# EAGLE design wheel-control (EAGLE 7.5.0)
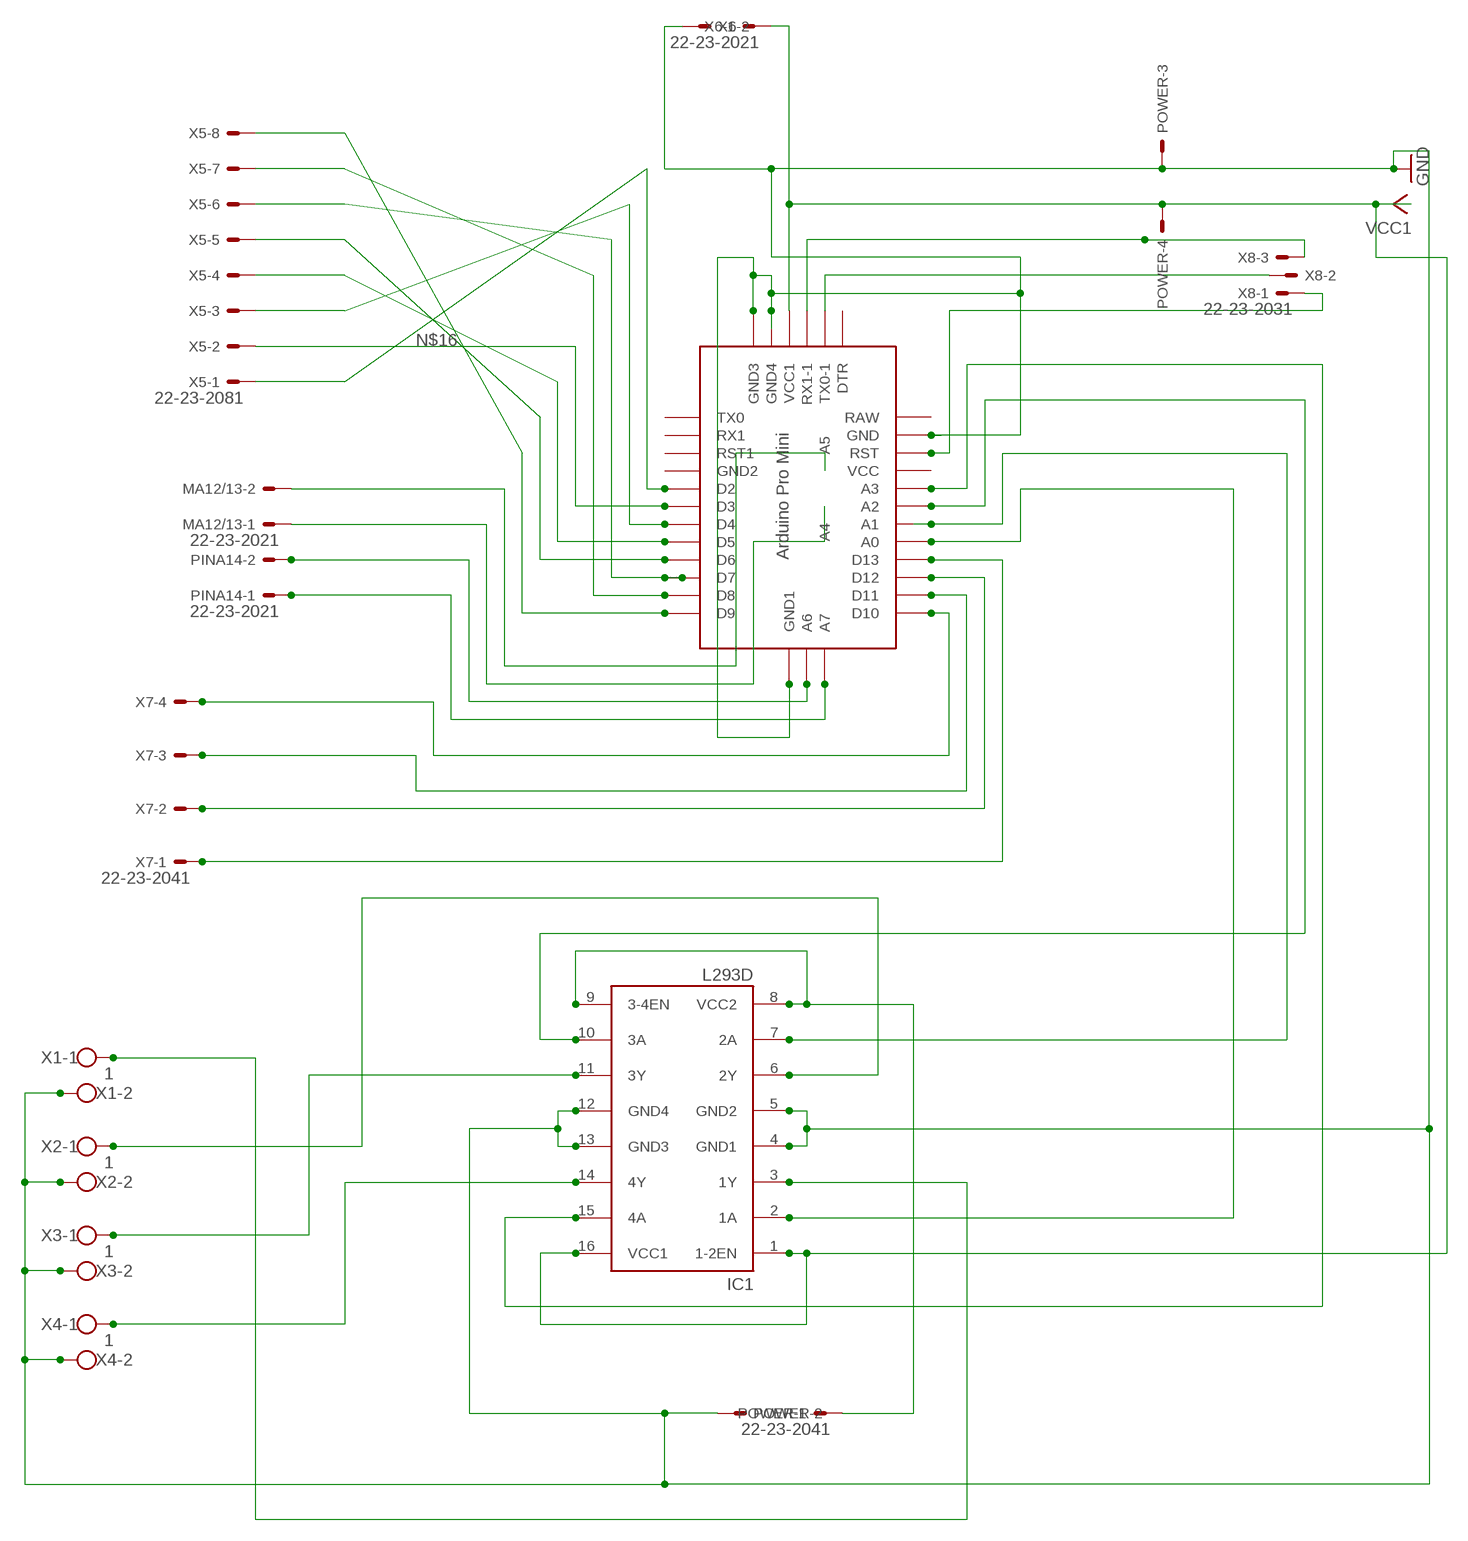
[diagram p0: schematic, sheet 1]

## Parts
IC1  L293D  [DIL16]
MA12/13  22-23-2021  [22-23-2021]
PINA14  22-23-2021  [22-23-2021]
POWER  22-23-2041  [22-23-2041]
U$1  ABK-PRO-MINI  [ABK-PRO-MINI]
X1  1  W237-102  [W237-102]
X2  1  W237-102  [W237-102]
X3  1  W237-102  [W237-102]
X4  1  W237-102  [W237-102]
X5  22-23-2081  [22-23-2081]
X6  22-23-2021  [22-23-2021]
X7  22-23-2041  [22-23-2041]
X8  22-23-2031  [22-23-2031]

## Nets
GND: IC1.4(GND1) IC1.5(GND2) IC1.12(GND4) IC1.13(GND3) POWER.2 POWER.3 U$1.GND U$1.GND2(GND3) U$1.GND3(GND4) U$1.GND4(GND1) X1.2 X2.2 X3.2 X4.2 X6.2
N$1: U$1.TX0-1 X8.2
N$2: IC1.15(4A) U$1.A3
N$3: U$1.D10 X7.4
N$4: IC1.10(3A) U$1.A2
N$5: U$1.RST X8.1
N$9: IC1.11(3Y) X3.1
N$10: U$1.D4 X5.3
N$11: U$1.D7 X5.6
N$12: U$1.D8 X5.7
N$13: U$1.D2 X5.1
N$14: U$1.D3 X5.2
N$15: U$1.D5 X5.4
N$16: U$1.D6 X5.5
N$17: U$1.D9 X5.8
N$18: MA12/13.2 U$1.A5
N$19: MA12/13.1 U$1.A4
N$20: PINA14.2 U$1.A6
N$21: PINA14.1 U$1.A7
N$22: IC1.7(2A) U$1.A1
N$23: U$1.RX1-1 X8.3
N$24: U$1.D11 X7.3
N$25: U$1.D12 X7.2
N$26: U$1.D13 X7.1
N$27: IC1.8(VCC2) IC1.9(3-4EN) POWER.1
N$28: IC1.14(4Y) X4.1
N$30: IC1.3(1Y) X1.1
N$31: IC1.6(2Y) X2.1
N$32: IC1.2(1A) U$1.A0
VCC: IC1.1(1-2EN) IC1.16(VCC1) POWER.4 U$1.VCC1 X6.1 ; supply symbol labelled VCC1
Unconnected: U$1.DTR U$1.GND1(GND2) U$1.RAW U$1.RST1 U$1.RX1 U$1.TX0 U$1.VCC

## Library data of the parts
IC1 = st-microelectronics:L293D: PUSH-PULL 4 CHANNEL DRIVER; MPN: L293D; OC_FARNELL: 9589619; OC_NEWARK: 56P8249
MA12/13 PINA14 X6 = con-molex:22-23-2021: .100" (2.54mm) Center Header - 2 Pin; MF: MOLEX; MPN: 22-23-2021; OC_FARNELL: 1462926; OC_NEWARK: 25C3832
POWER X7 = con-molex:22-23-2041: .100" (2.54mm) Center Header - 4 Pin; MF: MOLEX; MPN: 22-23-2041; OC_FARNELL: 1462920; OC_NEWARK: 38C0355
U$1 = Arduino-clone:ABK-PRO-MINI: ABK Pro-Mini Arduino Clone
X1-X4 = con-wago-500:W237-102: WAGO SCREW CLAMP; MPN: 237-102; OC_FARNELL: unknown; OC_NEWARK: 70K9898
X5 = con-molex:22-23-2081: .100" (2.54mm) Center Header - 8 Pin; MF: MOLEX; MPN: 22-23-2081; OC_FARNELL: 1756826; OC_NEWARK: 01C7592
X8 = con-molex:22-23-2031: .100" (2.54mm) Center Header - 3 Pin; MF: MOLEX; MPN: 22-23-2031; OC_FARNELL: 1462950; OC_NEWARK: 30C0862

## Net classes
0 default: width 0.2 mm, drill 0.8 mm, clearance 0.2 mm

## Board
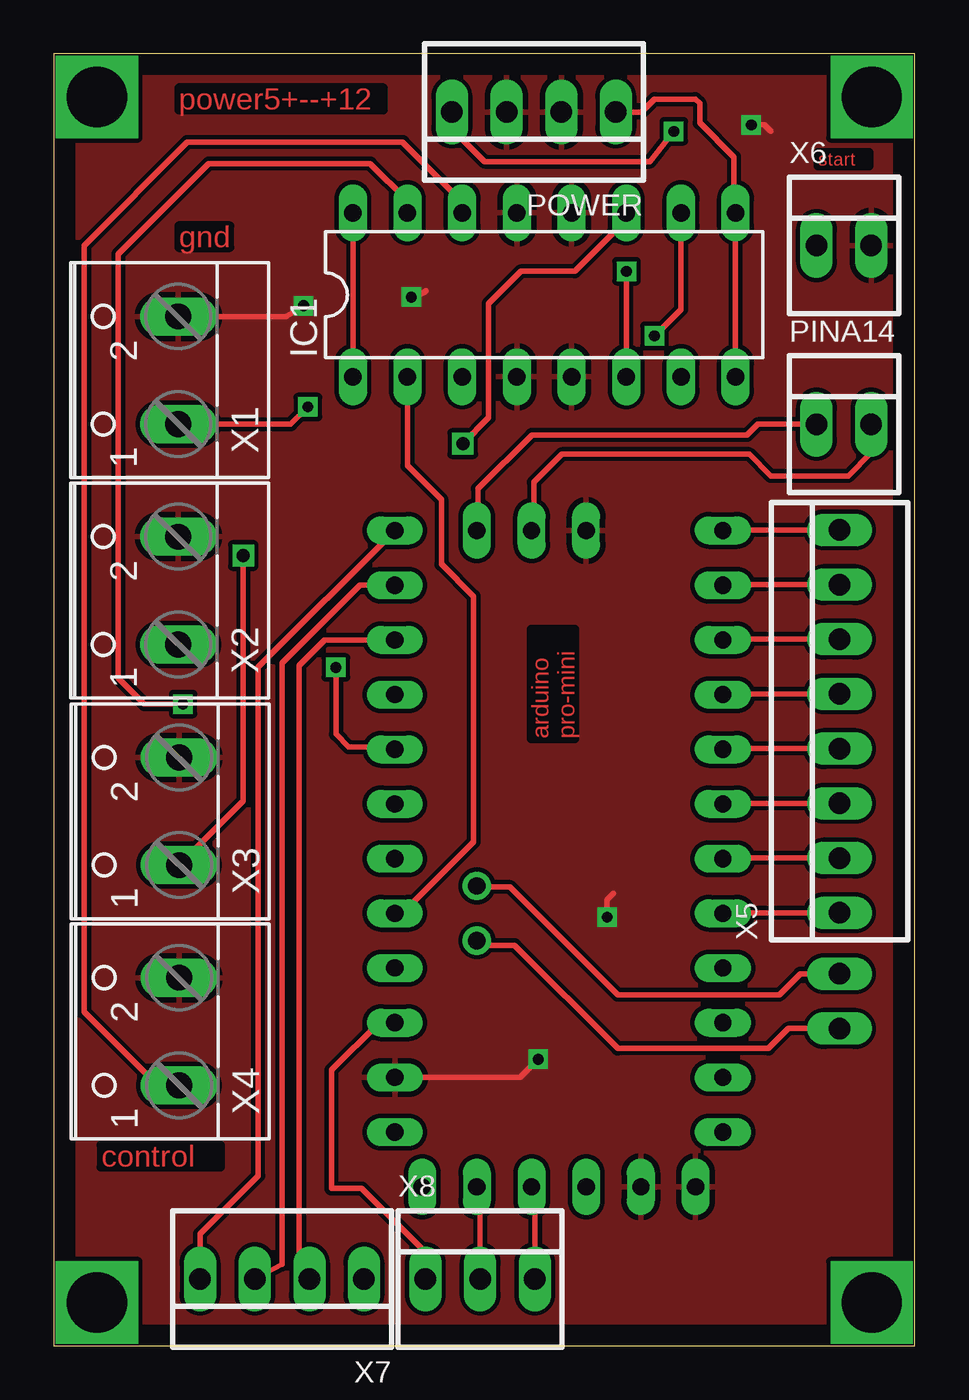
[diagram p1: board, top side]
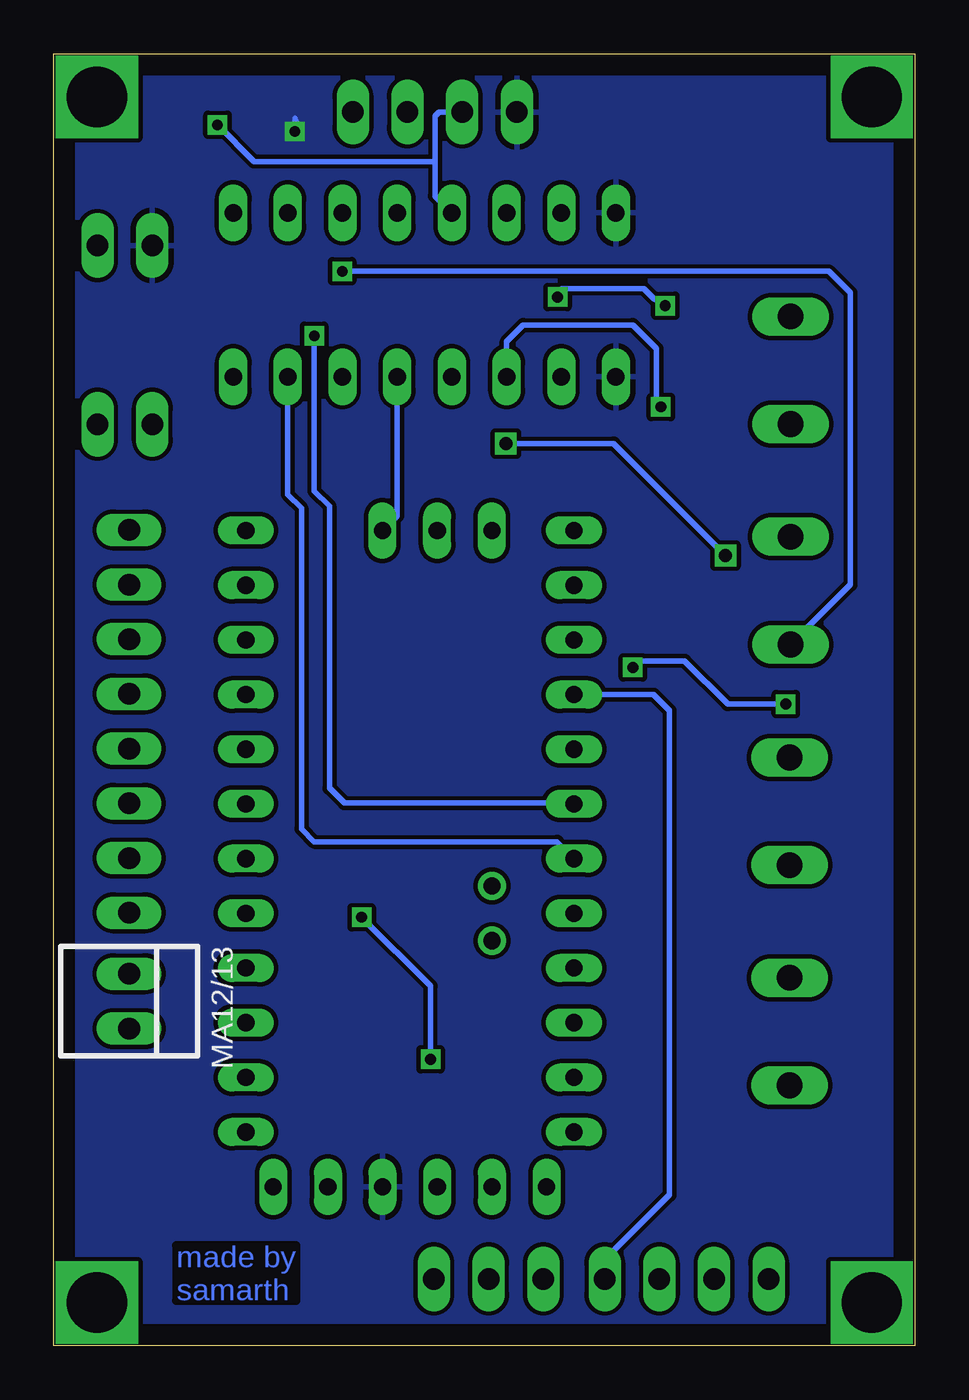
[diagram p2: board, bottom side, seen from below]

Size 40 x 60 mm. Coordinates in mm from the lower left corner, seen from the top.
Outline: 0,0 40,0 40,60 0,60 0,0
Copper layers (1*16): Top 0.035mm / dielectric 1.53mm / Bottom 0.035mm
Design rules "default *": minimum track width 1mil, minimum drill 4mil, track to track 8mil, track to pad 8mil, pad to pad 8mil, via to via 8mil, smd to smd 8mil, copper to edge 1mm, drill to drill 2mil, minimum pad ring 10mil, minimum via ring 8mil, stop-mask expansion 4mil, vias tented up to drill 0mil, thermal gap 10mil

### Footprints (pad centres in the part's own frame; a part is rotated, then mirrored left to right if it is on the bottom)
DIL16 = drill 0.813 long: 1 -8.89,-3.81; 2 -6.35,-3.81; 3 -3.81,-3.81; 4 -1.27,-3.81; 5 1.27,-3.81; 6 3.81,-3.81; 7 6.35,-3.81; 8 8.89,-3.81; 9 8.89,3.81; 10 6.35,3.81; 11 3.81,3.81; 12 1.27,3.81; 13 -1.27,3.81; 14 -3.81,3.81; 15 -6.35,3.81; 16 -8.89,3.81
22-23-2021 = drill 1 long: 1 -1.27,0; 2 1.27,0
22-23-2041 = drill 1 long: 1 -3.81,0; 2 -1.27,0; 3 1.27,0; 4 3.81,0
ABK-PRO-MINI = drill 0.8 long: A0 10.16,-3.81; A1 10.16,-6.35; A2 10.16,-8.89; A3 10.16,-11.43; A6 3.81,-21.59; A7 6.35,-21.59; D2 -5.08,-3.81; D3 -5.08,-6.35; D4 -5.08,-8.89; D5 -5.08,-11.43; D6 -5.08,-13.97; D7 -5.08,-16.51; D8 -5.08,-19.05; D9 -5.08,-21.59; D10 10.16,-21.59; D11 10.16,-19.05; D12 10.16,-16.51; D13 10.16,-13.97; DTR 8.89,8.89; GND 10.16,3.81; GND1 -5.08,-1.27; GND2 -3.81,8.89; GND3 -1.27,8.89; GND4 1.27,-21.59; RAW 10.16,6.35; RST 10.16,1.27; RST1 -5.08,1.27; RX1 -5.08,3.81; RX1-1 3.81,8.89; TX0 -5.08,6.35; TX0-1 6.35,8.89; VCC 10.16,-1.27; VCC1 1.27,8.89 | drill 0.8: A4 6.35,-5.08; A5 6.35,-2.54
W237-102 = drill 1.194 long: 1 -2.5,-1.27; 2 2.5,-1.27
22-23-2081 = drill 1 long: 1 -8.89,0; 2 -6.35,0; 3 -3.81,0; 4 -1.27,0; 5 1.27,0; 6 3.81,0; 7 6.35,0; 8 8.89,0
22-23-2031 = drill 1 long: 1 -2.54,0; 2 0,0; 3 2.54,0

### Placement (x,y rotation side)
IC1  22.78,48.81 0 top
MA12/13  36.5,16 270 bottom
PINA14  36.7,42.8 0 top
POWER  22.3,57.3 180 top
U$1  26,16.27 180 top
X1  4.51,45.3 90 top
X2  4.51,35.07 90 top
X3  4.55,24.82 90 top
X4  4.55,14.59 90 top
X5  36.5,29 90 top
X6  36.7,51.1 0 top
X7  10.6,3.1 180 top
X8  19.8,3.1 0 top

### Tracks (layer width: path | path; a pad name or v marks a point on that pad's centre or on a via)
GND  (via drill 0.5)
  Top 0.254: X1.2 10.8,47.8 v11.6,48.3 | v16.6,48.7 17.2,48.9 17.3,49 | U$1.GND 21.66,12.46 v22.5,13.3 | v25.7,19.9 25.7,20.7 26,21 | v32.4,56.7 33,56.7 33.3,56.4
  Bottom 0.254: IC1.5 24.05,38.54 U$1.GND4 | POWER.3 22.1,57.3 22.3,57.1 22.3,55 | 22.3,55 22.3,53.41 | 22.3,53.41 IC1.13 22.3,53.4 22.3,53.41 | v11.6,48.3 12.1,48.6 12.6,49.1 16.4,49.1 v16.6,48.7 | v22.5,13.3 22.5,16.7 v25.7,19.9 | 22.3,55 30.7,55 v32.4,56.7
  pour Top: 0,60 40,60 40,0 0,0
N$1
  Top 0.254: U$1.TX0-1 19.8,7.23 X8.2
N$2  (via drill 0.5)
  Top 0.254: IC1.15 16.43,53.17 14.7,54.9 7.2,54.9 3,50.7 3,31 4.2,29.8 v6,29.8 | v13.1,31.5 13.1,28.4 13.7,27.8 15.74,27.8 U$1.A3
  Bottom 0.254: v6,29.8 8.7,29.8 10.7,31.8 12.8,31.8 v13.1,31.5
N$3
  Top 0.254: X7.4 6.79,5.19 9.5,7.9 9.5,31.52 U$1.D10
N$4  (via drill 0.5)
  Top 0.254: IC1.10 29.13,48.13 v27.9,46.9
  Bottom 0.254: v27.9,46.9 27.9,39.7 27.2,39 27.2,25.9 26.5,25.2 15.88,25.2 U$1.A2
N$5
  Top 0.254: U$1.RST 15.1,15 12.9,12.8 12.9,7.3 14.3,7.3 17.2,4.4 17.2,3.16 X8.1 17.26,2.94
N$6  (via drill 2.8)
  other vias: 2,2
N$7  (via drill 2.8)
  other vias: 2,58
N$8  (via drill 2.8)
  other vias: 38,58
N$9  (via drill 0.6)
  Top 0.254: IC1.11 26.59,52.29 24.2,49.9 21.7,49.9 20.2,48.4 20.2,43.1 v19,41.9 | v8.8,36.7 8.8,25.3 X3.1
  Bottom 0.254: v19,41.9 14,41.9 v8.8,36.7
N$10
  Top 0.254: X5.3 31.11,25.19 U$1.D4
N$11
  Top 0.254: X5.6 31.11,32.81 U$1.D7
N$12
  Top 0.254: X5.7 31.11,35.35 U$1.D8
N$13
  Top 0.254: X5.1 31.11,20.11 U$1.D2
N$14
  Top 0.254: X5.2 31.11,22.65 U$1.D3
N$15
  Top 0.254: X5.4 31.11,27.73 U$1.D5
N$16
  Top 0.254: X5.5 31.11,30.27 U$1.D6
N$17
  Top 0.254: X5.8 31.11,37.89 U$1.D9
N$18
  Top 0.254: MA12/13.2 34.13,14.73 33.2,13.8 26.2,13.8 21.4,18.6 19.86,18.6 U$1.A5
N$19
  Top 0.254: MA12/13.1 34.67,17.27 33.7,16.3 26.2,16.3 21.2,21.3 19.7,21.3 U$1.A4
N$20
  Top 0.254: PINA14.2 37.97,41.47 36.9,40.4 33.3,40.4 32.3,41.4 23.6,41.4 22.3,40.1 22.3,37.97 U$1.A6
N$21
  Top 0.254: PINA14.1 32.7,42.8 32.2,42.3 22.2,42.3 19.7,39.8 19.7,37.91 U$1.A7
N$22
  Bottom 0.254: IC1.7 29.13,39.53 28.5,38.9 28.5,24 27.9,23.4 16.62,23.4 U$1.A1
N$23
  Top 0.254: U$1.RX1-1 22.34,7.23 X8.3
N$24
  Top 0.254: U$1.D11 14.22,35.32 10.6,31.7 10.6,3.77 X7.3
N$25
  Top 0.254: U$1.D12 12.58,32.78 11.4,31.6 11.4,2.97 X7.2
N$26
  Bottom 0.254: U$1.D13 12.14,30.24 11.4,29.5 11.4,7 14,4.4 14,2.91 X7.1
N$27
  Top 0.254: IC1.8 IC1.9 31.6,52.69 31.6,55.2 30,56.8 30,57.7 29.8,57.9 27.9,57.9 27.3,57.3 POWER.1
N$28
  Top 0.254: IC1.14 18.97,53.53 18.57,53.53 16.2,55.9 6.2,55.9 1.4,51.1 1.4,15.5 5,11.9 5.63,11.9 X4.1
N$29  (via drill 2.8)
  other vias: 38,2
N$30  (via drill 0.5)
  Top 0.254: X1.1 11,42.8 v11.8,43.6
  Bottom 0.254: IC1.3 18.97,46.63 18.2,47.4 13.1,47.4 12,46.3 12,43.8 v11.8,43.6
N$31  (via drill 0.5)
  Top 0.254: IC1.6 26.59,48.61 v26.6,49.9
  Bottom 0.254: v26.6,49.9 4,49.9 3,48.9 3,35.35 X2.1 5.81,32.6
N$32
  Top 0.254: IC1.2 16.43,40.87 18,39.3 18,36.3 19.5,34.8 19.5,23.4 16.6,20.5 16.26,20.5 U$1.A0
VCC  (via drill 0.5)
  Top 0.254: POWER.4 18.49,56.51 20,55 27.7,55 v28.8,56.4 | IC1.16 IC1.1
  Bottom 0.254: v28.8,56.4 28.8,57 28.5,56.4
  pour Bottom: 0,60 40,60 40,0 0,0

### Text on the board
Top: power5+--+12 | start | gnd | arduino / pro-mini | control
Bottom: made by / samarth